# Altium schematic sheet MotorDriver.SchDoc
size A4; SheetNumber: 9; SheetTotal: 15
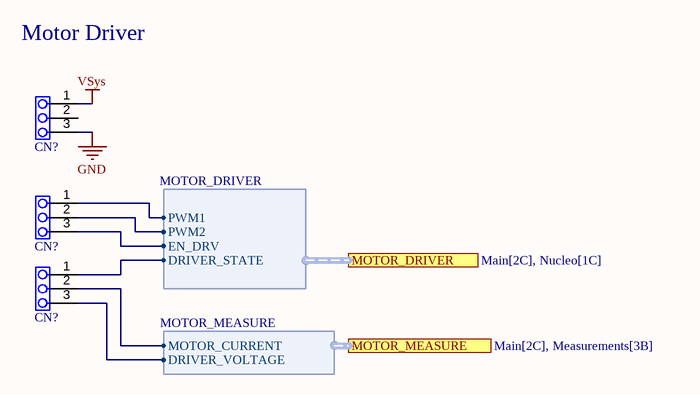
[diagram p0: MotorDriver.SchDoc]

## Parts
(Parts that share a designator on the sheet are numbered #1, #2 ... from top to bottom, then left to right.)
CN?#1  Pins 1x3  [PIN-1X3]  (value not drawn)
CN?#2  Pins 1x3  [PIN-1X3]  (value not drawn)
CN?#3  Pins 1x3  [PIN-1X3]  (value not drawn)

## Ports
MOTOR_DRIVER (harness MOTOR_DRIVER, see Main[2C], Nucleo[1C]), MOTOR_MEASURE (harness MOTOR_MEASURE, see Main[2C], Measurements[3B])

## Harnesses
MOTOR_DRIVER: PWM1, PWM2, EN_DRV, DRIVER_STATE
MOTOR_MEASURE: MOTOR_CURRENT, DRIVER_VOLTAGE

## Nets
GND: CN?#1.3
VSys: CN?#1.1
NetCN?#2_1: CN?#2.1 ; port MOTOR_DRIVER.PWM1
NetCN?#2_2: CN?#2.2 ; port MOTOR_DRIVER.PWM2
NetCN?#2_3: CN?#2.3 ; port MOTOR_DRIVER.EN_DRV
NetCN?#3_1: CN?#3.1 ; port MOTOR_DRIVER.DRIVER_STATE
NetCN?#3_2: CN?#3.2 ; port MOTOR_MEASURE.MOTOR_CURRENT
NetCN?#3_3: CN?#3.3 ; port MOTOR_MEASURE.DRIVER_VOLTAGE

Not connected (* = marked no-connect by the designer): CN?#1 2

## Notes on the sheet
- Motor Driver
- Size
- Date
- A4
- Title
- Sheet number
- Author
- Revision

## Library data of the parts
CN?#1-CN?#3 = Pins 1x3: 1x3 2.54mm; Part Class: Connector; Order Code: 855-M50-3530342; CompType: M50-3530342; Distributor: Mouser; Package: SMD 1.27mm